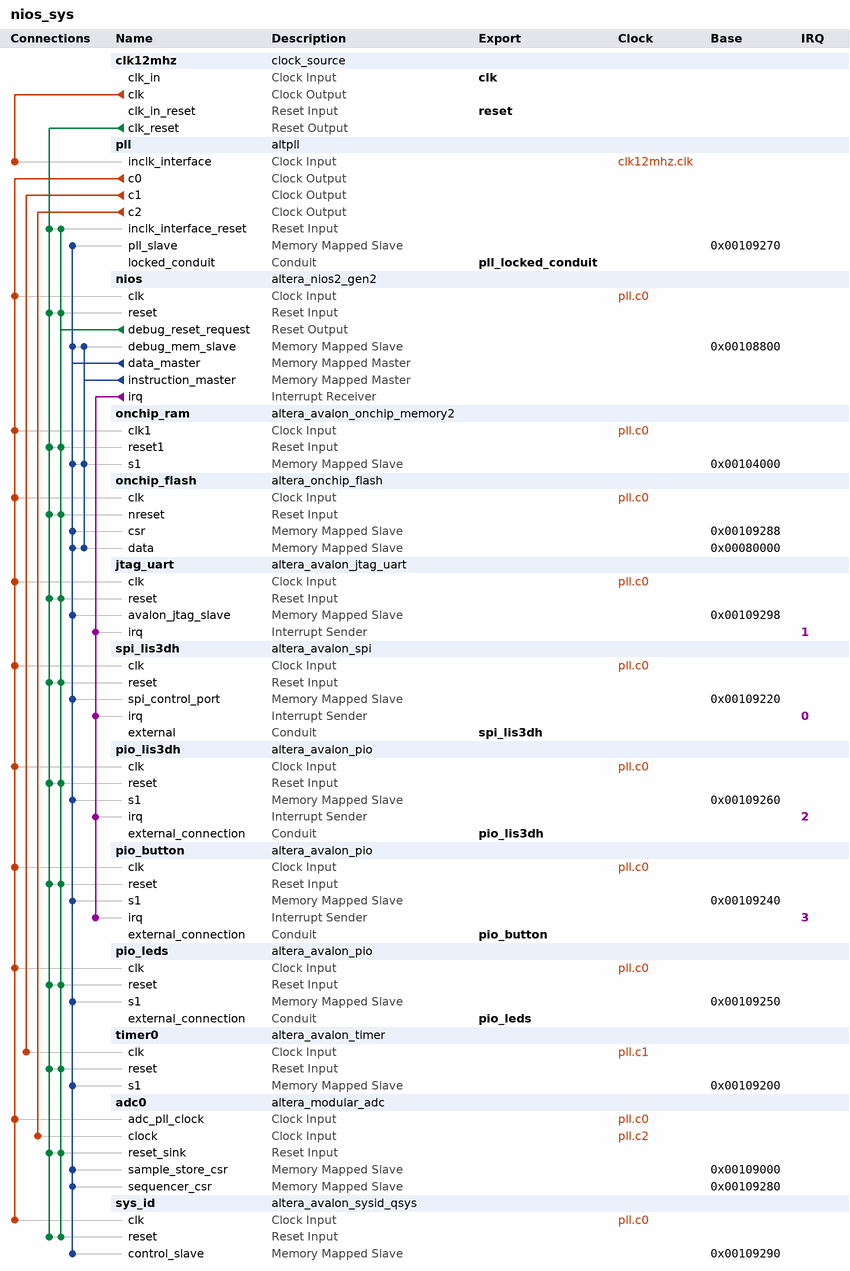
[diagram p0: system contents]
# Platform Designer (Qsys) system nios_sys, MAX 10 10M08SAU169C8G
# Parameters at their usual value, and those the tool derives, are not listed.
package require -exact qsys 18.1
create_system nios_sys
set_project_property DEVICE_FAMILY {MAX 10}
set_project_property DEVICE 10M08SAU169C8G

add_instance clk12mhz clock_source 18.1
set_instance_parameter_value clk12mhz clockFrequency 12000000

add_instance pll altpll 18.1
set_instance_parameter_value pll CLK0_DIVIDE_BY 3
set_instance_parameter_value pll CLK0_MULTIPLY_BY 20
set_instance_parameter_value pll CLK1_DIVIDE_BY 3
set_instance_parameter_value pll CLK1_DUTY_CYCLE 50
set_instance_parameter_value pll CLK1_MULTIPLY_BY 10
set_instance_parameter_value pll CLK1_PHASE_SHIFT 0
set_instance_parameter_value pll CLK2_DIVIDE_BY 6
set_instance_parameter_value pll CLK2_DUTY_CYCLE 50
set_instance_parameter_value pll CLK2_MULTIPLY_BY 5
set_instance_parameter_value pll CLK2_PHASE_SHIFT 0
set_instance_parameter_value pll INCLK0_INPUT_FREQUENCY 83333
set_instance_parameter_value pll PORT_ARESET PORT_UNUSED
set_instance_parameter_value pll PORT_LOCKED PORT_USED
set_instance_parameter_value pll PORT_clk1 PORT_USED
set_instance_parameter_value pll PORT_clk2 PORT_USED
set_instance_parameter_value pll PORT_clk3 PORT_UNUSED

add_instance nios altera_nios2_gen2 18.1
set_instance_parameter_value nios dcache_size 2048
set_instance_parameter_value nios exceptionSlave onchip_ram.s1
set_instance_parameter_value nios icache_size 4096
set_instance_parameter_value nios impl Tiny
set_instance_parameter_value nios resetSlave onchip_ram.s1

add_instance onchip_ram altera_avalon_onchip_memory2 18.1
set_instance_parameter_value onchip_ram dataWidth 32
set_instance_parameter_value onchip_ram dualPort false
set_instance_parameter_value onchip_ram initMemContent true
set_instance_parameter_value onchip_ram initializationFileName onchip_mem.hex
set_instance_parameter_value onchip_ram memorySize 16384

add_instance onchip_flash altera_onchip_flash 18.1
set_instance_parameter_value onchip_flash CLOCK_FREQUENCY 80.0
set_instance_parameter_value onchip_flash CONFIGURATION_MODE {Single Uncompressed Image with Memory Initialization}
set_instance_parameter_value onchip_flash SECTOR_ACCESS_MODE {Read and write,Read and write,Read and write,Read and write,Read and write}
set_instance_parameter_value onchip_flash initFlashContent false
set_instance_parameter_value onchip_flash initializationFileName altera_onchip_flash.hex
set_instance_parameter_value onchip_flash useNonDefaultInitFile false

add_instance jtag_uart altera_avalon_jtag_uart 18.1
set_instance_parameter_value jtag_uart simInteractiveOptions NO_INTERACTIVE_WINDOWS

add_instance spi_lis3dh altera_avalon_spi 18.1
set_instance_parameter_value spi_lis3dh clockPhase 1
set_instance_parameter_value spi_lis3dh clockPolarity 1
set_instance_parameter_value spi_lis3dh dataWidth 8
set_instance_parameter_value spi_lis3dh masterSPI true
set_instance_parameter_value spi_lis3dh numberOfSlaves 1
set_instance_parameter_value spi_lis3dh targetClockRate 1000000

add_instance pio_lis3dh altera_avalon_pio 18.1
set_instance_parameter_value pio_lis3dh captureEdge true
set_instance_parameter_value pio_lis3dh direction Input
set_instance_parameter_value pio_lis3dh generateIRQ true
set_instance_parameter_value pio_lis3dh irqType EDGE
set_instance_parameter_value pio_lis3dh simDoTestBenchWiring true
set_instance_parameter_value pio_lis3dh width 2

add_instance pio_button altera_avalon_pio 18.1
set_instance_parameter_value pio_button captureEdge true
set_instance_parameter_value pio_button direction Input
set_instance_parameter_value pio_button generateIRQ true
set_instance_parameter_value pio_button irqType EDGE
set_instance_parameter_value pio_button width 1

add_instance pio_leds altera_avalon_pio 18.1
set_instance_parameter_value pio_leds direction Output
set_instance_parameter_value pio_leds width 8

add_instance timer0 altera_avalon_timer 18.1
set_instance_parameter_value timer0 period 1
set_instance_parameter_value timer0 periodUnits MSEC

add_instance adc0 altera_modular_adc 18.1
set_instance_parameter_value adc0 CLOCK_FREQ 10000000
set_instance_parameter_value adc0 CORE_VAR 0
set_instance_parameter_value adc0 DEVICE_PART 10M08SAU169C8G
set_instance_parameter_value adc0 clkdiv 2
set_instance_parameter_value adc0 int_vref_vr 3.0
set_instance_parameter_value adc0 refsel 0
set_instance_parameter_value adc0 sample_rate 0
set_instance_parameter_value adc0 seq_order_length 1
set_instance_parameter_value adc0 seq_order_slot_1 0
set_instance_parameter_value adc0 seq_order_slot_2 30
set_instance_parameter_value adc0 seq_order_slot_3 30
set_instance_parameter_value adc0 seq_order_slot_4 30
set_instance_parameter_value adc0 seq_order_slot_5 30
set_instance_parameter_value adc0 seq_order_slot_6 30
set_instance_parameter_value adc0 seq_order_slot_7 30
set_instance_parameter_value adc0 use_ch0 true
set_instance_parameter_value adc0 use_ch1 false
set_instance_parameter_value adc0 use_ch2 false
set_instance_parameter_value adc0 use_ch3 false
set_instance_parameter_value adc0 use_ch4 false
set_instance_parameter_value adc0 use_ch5 false
set_instance_parameter_value adc0 use_ch6 false
set_instance_parameter_value adc0 use_ch7 false
set_instance_parameter_value adc0 use_ch8 false
set_instance_parameter_value adc0 use_tsd false

add_instance sys_id altera_avalon_sysid_qsys 18.1
set_instance_parameter_value sys_id id 4660

# connections
add_connection clk12mhz.clk pll.inclk_interface clock
add_connection pll.c0 adc0.adc_pll_clock clock
add_connection pll.c0 jtag_uart.clk clock
add_connection pll.c0 nios.clk clock
add_connection pll.c0 onchip_flash.clk clock
add_connection pll.c0 onchip_ram.clk1 clock
add_connection pll.c0 pio_button.clk clock
add_connection pll.c0 pio_leds.clk clock
add_connection pll.c0 pio_lis3dh.clk clock
add_connection pll.c0 spi_lis3dh.clk clock
add_connection pll.c0 sys_id.clk clock
add_connection pll.c1 timer0.clk clock
add_connection pll.c2 adc0.clock clock
add_connection clk12mhz.clk_reset adc0.reset_sink reset
add_connection clk12mhz.clk_reset jtag_uart.reset reset
add_connection clk12mhz.clk_reset nios.reset reset
add_connection clk12mhz.clk_reset onchip_flash.nreset reset
add_connection clk12mhz.clk_reset onchip_ram.reset1 reset
add_connection clk12mhz.clk_reset pio_button.reset reset
add_connection clk12mhz.clk_reset pio_leds.reset reset
add_connection clk12mhz.clk_reset pio_lis3dh.reset reset
add_connection clk12mhz.clk_reset pll.inclk_interface_reset reset
add_connection clk12mhz.clk_reset spi_lis3dh.reset reset
add_connection clk12mhz.clk_reset sys_id.reset reset
add_connection clk12mhz.clk_reset timer0.reset reset
add_connection nios.debug_reset_request adc0.reset_sink reset
add_connection nios.debug_reset_request jtag_uart.reset reset
add_connection nios.debug_reset_request nios.reset reset
add_connection nios.debug_reset_request onchip_flash.nreset reset
add_connection nios.debug_reset_request onchip_ram.reset1 reset
add_connection nios.debug_reset_request pio_button.reset reset
add_connection nios.debug_reset_request pio_leds.reset reset
add_connection nios.debug_reset_request pio_lis3dh.reset reset
add_connection nios.debug_reset_request pll.inclk_interface_reset reset
add_connection nios.debug_reset_request spi_lis3dh.reset reset
add_connection nios.debug_reset_request sys_id.reset reset
add_connection nios.debug_reset_request timer0.reset reset
add_connection nios.data_master adc0.sample_store_csr avalon
set_connection_parameter_value nios.data_master/adc0.sample_store_csr baseAddress 0x00109000
add_connection nios.data_master adc0.sequencer_csr avalon
set_connection_parameter_value nios.data_master/adc0.sequencer_csr baseAddress 0x00109280
add_connection nios.data_master jtag_uart.avalon_jtag_slave avalon
set_connection_parameter_value nios.data_master/jtag_uart.avalon_jtag_slave baseAddress 0x00109298
add_connection nios.data_master nios.debug_mem_slave avalon
set_connection_parameter_value nios.data_master/nios.debug_mem_slave baseAddress 0x00108800
add_connection nios.data_master onchip_flash.csr avalon
set_connection_parameter_value nios.data_master/onchip_flash.csr baseAddress 0x00109288
add_connection nios.data_master onchip_flash.data avalon
set_connection_parameter_value nios.data_master/onchip_flash.data baseAddress 0x00080000
add_connection nios.data_master onchip_ram.s1 avalon
set_connection_parameter_value nios.data_master/onchip_ram.s1 baseAddress 0x00104000
add_connection nios.data_master pio_button.s1 avalon
set_connection_parameter_value nios.data_master/pio_button.s1 baseAddress 0x00109240
add_connection nios.data_master pio_leds.s1 avalon
set_connection_parameter_value nios.data_master/pio_leds.s1 baseAddress 0x00109250
add_connection nios.data_master pio_lis3dh.s1 avalon
set_connection_parameter_value nios.data_master/pio_lis3dh.s1 baseAddress 0x00109260
add_connection nios.data_master pll.pll_slave avalon
set_connection_parameter_value nios.data_master/pll.pll_slave baseAddress 0x00109270
add_connection nios.data_master spi_lis3dh.spi_control_port avalon
set_connection_parameter_value nios.data_master/spi_lis3dh.spi_control_port baseAddress 0x00109220
add_connection nios.data_master sys_id.control_slave avalon
set_connection_parameter_value nios.data_master/sys_id.control_slave baseAddress 0x00109290
add_connection nios.data_master timer0.s1 avalon
set_connection_parameter_value nios.data_master/timer0.s1 baseAddress 0x00109200
add_connection nios.instruction_master nios.debug_mem_slave avalon
set_connection_parameter_value nios.instruction_master/nios.debug_mem_slave baseAddress 0x00108800
add_connection nios.instruction_master onchip_flash.data avalon
set_connection_parameter_value nios.instruction_master/onchip_flash.data baseAddress 0x00080000
add_connection nios.instruction_master onchip_ram.s1 avalon
set_connection_parameter_value nios.instruction_master/onchip_ram.s1 baseAddress 0x00104000
add_connection nios.irq jtag_uart.irq interrupt
set_connection_parameter_value nios.irq/jtag_uart.irq irqNumber 1
add_connection nios.irq pio_button.irq interrupt
set_connection_parameter_value nios.irq/pio_button.irq irqNumber 3
add_connection nios.irq pio_lis3dh.irq interrupt
set_connection_parameter_value nios.irq/pio_lis3dh.irq irqNumber 2
add_connection nios.irq spi_lis3dh.irq interrupt
set_connection_parameter_value nios.irq/spi_lis3dh.irq irqNumber 0

# exported interfaces
add_interface clk clock sink
set_interface_property clk EXPORT_OF clk12mhz.clk_in
add_interface pio_button conduit end
set_interface_property pio_button EXPORT_OF pio_button.external_connection
add_interface pio_leds conduit end
set_interface_property pio_leds EXPORT_OF pio_leds.external_connection
add_interface pio_lis3dh conduit end
set_interface_property pio_lis3dh EXPORT_OF pio_lis3dh.external_connection
add_interface pll_locked_conduit conduit end
set_interface_property pll_locked_conduit EXPORT_OF pll.locked_conduit
add_interface reset reset sink
set_interface_property reset EXPORT_OF clk12mhz.clk_in_reset
add_interface spi_lis3dh conduit end
set_interface_property spi_lis3dh EXPORT_OF spi_lis3dh.external

set_interconnect_requirement {$system} qsys_mm.clockCrossingAdapter HANDSHAKE
set_interconnect_requirement {$system} qsys_mm.enableEccProtection FALSE
set_interconnect_requirement {$system} qsys_mm.insertDefaultSlave FALSE
set_interconnect_requirement {$system} qsys_mm.maxAdditionalLatency 1

save_system nios_sys.qsys
